# Altium schematic sheet Support.SchDoc: Support
size Letter; DrawnBy: Qinyang Bao, Nicole Rosario; Organization: UW Robotics; Address1: 200 University Avenue; Address2: Waterloo; Address3: Ontario; Address4: Canada N2L 3G6
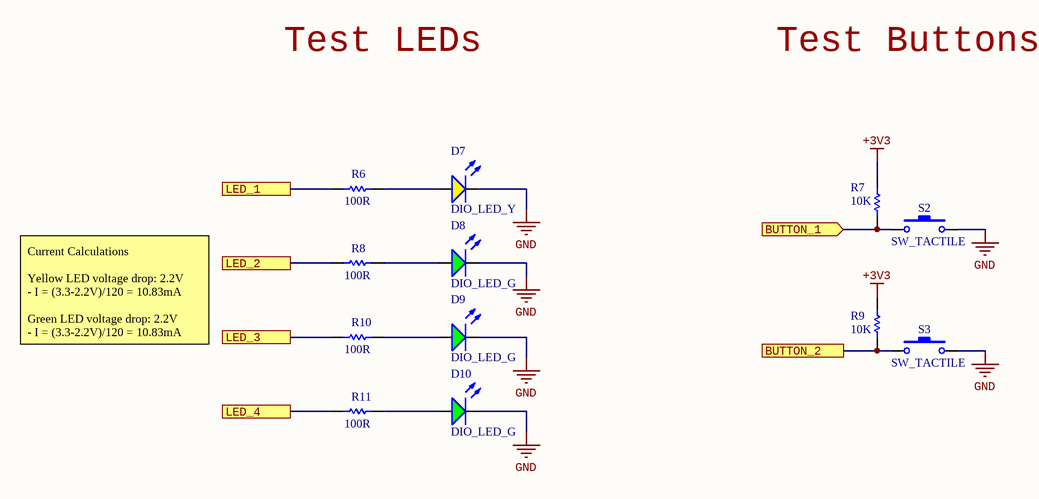
[diagram p0: Support.SchDoc]

## Parts
D7  DIO_LED_Y  [LED_0805_LINE]
D8  DIO_LED_G  [LED_0805_LINE]
D9  DIO_LED_G  [LED_0805_LINE]
D10  DIO_LED_G  [LED_0805_LINE]
R6  value 100R  [RESC0603(1608)_N]  (hidden comment: RES_100R_0603)
R7  value 10K  [RESC0603(1608)_N]  (hidden comment: RES_10K_0603)
R8  value 100R  [RESC0603(1608)_N]  (hidden comment: RES_100R_0603)
R9  value 10K  [RESC0603(1608)_N]  (hidden comment: RES_10K_0603)
R10  value 100R  [RESC0603(1608)_N]  (hidden comment: RES_100R_0603)
R11  value 100R  [RESC0603(1608)_N]  (hidden comment: RES_100R_0603)
S2  SW_TACTILE  [B3U-1100P]
S3  SW_TACTILE  [B3U-1100P]

## Ports
BUTTON_1 (in), BUTTON_2, LED_1, LED_2, LED_3, LED_4

## Nets
+3V3: R7.1 R9.2
GND: D7.2(K) D8.2(K) D9.2(K) D10.2(K) S2.2 S3.2
BUTTON_1: R7.2 S2.1 ; port BUTTON_1
BUTTON_2: R9.1 S3.1 ; port BUTTON_2
LED_1: R6.1 ; port LED_1
LED_2: R8.1 ; port LED_2
LED_3: R10.1 ; port LED_3
LED_4: R11.1 ; port LED_4
NetD7_1: D7.1(A) R6.2
NetD8_1: D8.1(A) R8.2
NetD9_1: D9.1(A) R10.2
NetD10_1: D10.1(A) R11.2

## Notes on the sheet
- Test LEDs
- Test Buttons
- Current Calculations
  Yellow LED voltage drop: 2.2V
  - I = (3.3-2.2V)/120 = 10.83mA
  Green LED voltage drop: 2.2V
  - I = (3.3-2.2V)/120 = 10.83mA
- Title
- Size:
- Date:
- Letter
- Drawn By:
- Sheet
- of
- File:

## Library data of the parts
D7 = DIO_LED_Y: LED YELLOW DIFFUSED 0805 SMD; Manufacturer: OSRAM; MPN: LY R976-PS-36; Forward Voltage Drop: 2.2V; Package: 0805 (2012 Metric); Supplier Part Number 1: 475-2560-1-ND; Supplier 1: Digi-Key
D8-D10 = DIO_LED_G: LED GREEN DIFFUSED 0805 SMD; Manufacturer: OSRAM; MPN: LG R971-KN-1; Forward Voltage Drop: 2.2V; Package: 0805 (2012 Metric); Supplier Part Number 1: 475-1410-1-ND; Supplier 1: Digi-Key
R6 R8 R10 R11 = RES_100R_0603: RES SMD 100 OHM 1% 1/10W 0603; Manufacturer: Yageo; MPN: RC0603FR-07100RL; Package: 0603 (1608 Metric); Dimensions: 0.063" L x 0.031" W (1.60mm x 0.80mm); Tolerance: 1%; Supplier Part Number 1: 311-100HRCT-ND; Supplier 1: Digi-Key
R7 R9 = RES_10K_0603: RES SMD 10K OHM 5% 1/10W 0603; Manufacturer: Yageo; MPN: RC0603JR-0710KL; Package: 0603 (1608 Metric); Dimensions: 0.063" L x 0.031" W (1.60mm x 0.80mm); Tolerance: 5%; Supplier Part Number 1: 311-10KGRCT-ND; Supplier 1: Digi-Key
S2 S3 = SW_TACTILE: Tactile Switch (Grey); Manufacturer: Omron Electronics Inc-EMC Div; MPN: B3U-1100P; Supplier 1: Digi-Key; Supplier Part Number 1: SW1021CT-ND